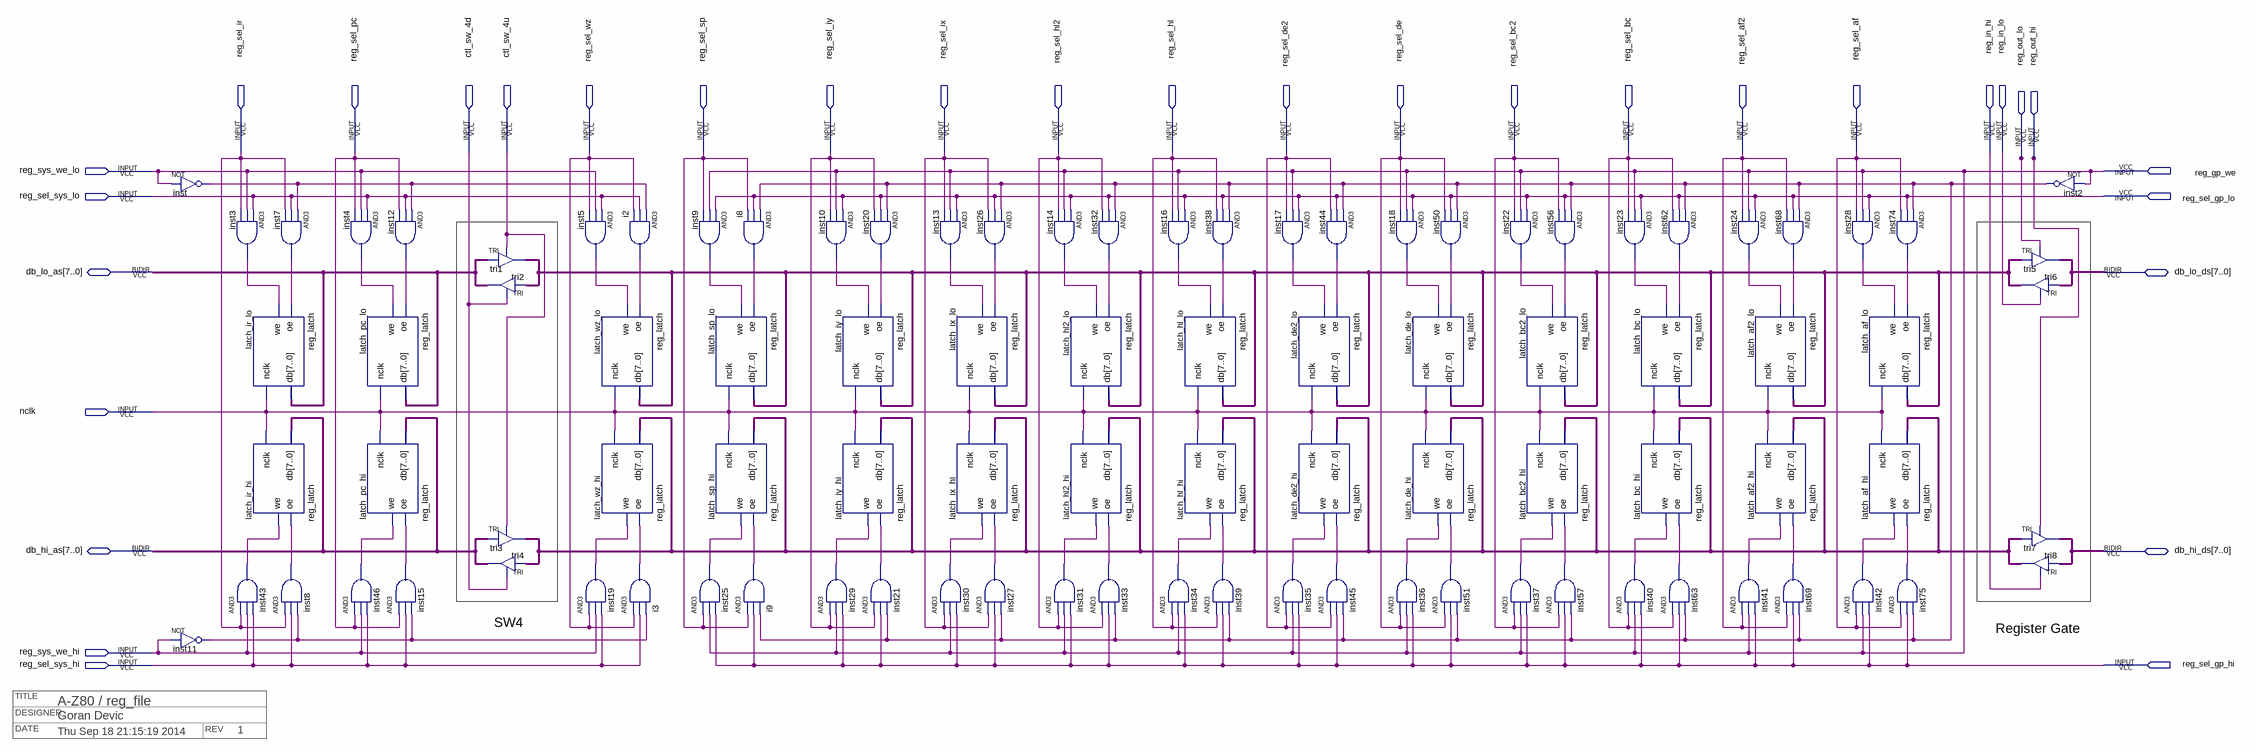
[diagram p0: schematic sheet]
// Quartus schematic reg_file.bdf as structural Verilog: 95 symbols, 32 pins
// Title block: TITLE: A-Z80 / reg_file; DESIGNER: Goran Devic; DATE: Thu Sep 18 21:15:19 2014; REV: 1
module reg_file (
  input  reg_sel_ir,
  input  reg_sel_pc,
  input  ctl_sw_4d,
  input  ctl_sw_4u,
  input  reg_sel_wz,
  input  reg_sel_sp,
  input  reg_sel_iy,
  input  reg_sel_ix,
  input  reg_sel_hl2,
  input  reg_sel_hl,
  input  reg_sel_de2,
  input  reg_sel_de,
  input  reg_sel_bc2,
  input  reg_sel_bc,
  input  reg_sel_af2,
  input  reg_sel_af,
  input  reg_in_hi,
  input  reg_in_lo,
  input  reg_out_lo,
  input  reg_out_hi,
  input  reg_sys_we_lo,
  input  reg_gp_we,
  input  reg_sel_sys_lo,
  input  reg_sel_gp_lo,
  input  nclk,
  input  reg_sys_we_hi,
  input  reg_sel_sys_hi,
  input  reg_sel_gp_hi,
  inout  [7:0] db_lo_as,
  inout  [7:0] db_lo_ds,
  inout  [7:0] db_hi_as,
  inout  [7:0] db_hi_ds
);

  wire i2_out, i3_out, i8_out, i9_out, inst2_out, inst3_out, inst4_out, inst5_out, inst7_out, inst8_out,
       inst9_out, inst10_out, inst11_out, inst12_out, inst13_out, inst14_out, inst15_out, inst16_out,
       inst17_out, inst18_out, inst19_out, inst20_out, inst21_out, inst22_out, inst23_out, inst24_out,
       inst25_out, inst26_out, inst27_out, inst28_out, inst29_out, inst30_out, inst31_out, inst32_out,
       inst33_out, inst34_out, inst35_out, inst36_out, inst37_out, inst38_out, inst39_out, inst40_out,
       inst41_out, inst42_out, inst43_out, inst44_out, inst45_out, inst46_out, inst50_out, inst51_out,
       inst56_out, inst57_out, inst62_out, inst63_out, inst68_out, inst69_out, inst74_out, inst75_out,
       inst_out;
  wire [7:0] tri1_out, tri3_out;

  not inst (inst_out, reg_sys_we_lo);
  not inst11 (inst11_out, reg_sys_we_hi);
  and inst3 (inst3_out, reg_sel_sys_lo, reg_sys_we_lo, reg_sel_ir);
  and inst43 (inst43_out, reg_sel_ir, reg_sys_we_hi, reg_sel_sys_hi);
  and inst7 (inst7_out, inst_out, reg_sel_sys_lo, reg_sel_ir);
  reg_latch latch_ir_lo (.oe(inst7_out), .nclk(nclk), .we(inst3_out), .db(db_lo_as));
  reg_latch latch_ir_hi (.oe(inst8_out), .nclk(nclk), .we(inst43_out), .db(db_hi_as));
  and inst8 (inst8_out, reg_sel_ir, reg_sel_sys_hi, inst11_out);
  and inst12 (inst12_out, inst_out, reg_sel_sys_lo, reg_sel_pc);
  and inst4 (inst4_out, reg_sel_sys_lo, reg_sys_we_lo, reg_sel_pc);
  reg_latch latch_pc_lo (.oe(inst12_out), .nclk(nclk), .we(inst4_out), .db(db_lo_as));
  reg_latch latch_pc_hi (.oe(inst15_out), .nclk(nclk), .we(inst46_out), .db(db_hi_as));
  and inst15 (inst15_out, reg_sel_pc, reg_sel_sys_hi, inst11_out);
  and inst46 (inst46_out, reg_sel_pc, reg_sys_we_hi, reg_sel_sys_hi);
  TRI \tri1 [7:0] (.IN(db_lo_as), .OE(ctl_sw_4u), .OUT(tri1_out));
  TRI tri2[7:0] (.IN(tri1_out), .OE(ctl_sw_4d), .OUT(db_lo_as));
  TRI tri3[7:0] (.IN(db_hi_as), .OE(ctl_sw_4u), .OUT(tri3_out));
  TRI tri4[7:0] (.IN(tri3_out), .OE(ctl_sw_4d), .OUT(db_hi_as));
  and inst5 (inst5_out, reg_sel_sys_lo, reg_sys_we_lo, reg_sel_wz);
  reg_latch latch_wz_lo (.oe(i2_out), .nclk(nclk), .we(inst5_out), .db(tri1_out));
  reg_latch latch_wz_hi (.oe(i3_out), .nclk(nclk), .we(inst19_out), .db(tri3_out));
  and inst19 (inst19_out, reg_sel_wz, reg_sys_we_hi, reg_sel_sys_hi);
  and i2 (i2_out, inst_out, reg_sel_sys_lo, reg_sel_wz);
  and i3 (i3_out, reg_sel_wz, reg_sel_sys_hi, inst11_out);
  and inst9 (inst9_out, reg_sel_gp_lo, reg_gp_we, reg_sel_sp);
  and inst25 (inst25_out, reg_sel_sp, reg_gp_we, reg_sel_gp_hi);
  and i8 (i8_out, inst2_out, reg_sel_gp_lo, reg_sel_sp);
  reg_latch latch_sp_lo (.oe(i8_out), .nclk(nclk), .we(inst9_out), .db(tri1_out));
  reg_latch latch_sp_hi (.oe(i9_out), .nclk(nclk), .we(inst25_out), .db(tri3_out));
  and i9 (i9_out, reg_sel_sp, reg_sel_gp_hi, inst2_out);
  and inst10 (inst10_out, reg_sel_gp_lo, reg_gp_we, reg_sel_iy);
  reg_latch latch_iy_lo (.oe(inst20_out), .nclk(nclk), .we(inst10_out), .db(tri1_out));
  reg_latch latch_iy_hi (.oe(inst21_out), .nclk(nclk), .we(inst29_out), .db(tri3_out));
  and inst29 (inst29_out, reg_sel_iy, reg_gp_we, reg_sel_gp_hi);
  and inst20 (inst20_out, inst2_out, reg_sel_gp_lo, reg_sel_iy);
  and inst21 (inst21_out, reg_sel_iy, reg_sel_gp_hi, inst2_out);
  and inst13 (inst13_out, reg_sel_gp_lo, reg_gp_we, reg_sel_ix);
  reg_latch latch_ix_lo (.oe(inst26_out), .nclk(nclk), .we(inst13_out), .db(tri1_out));
  reg_latch latch_ix_hi (.oe(inst27_out), .nclk(nclk), .we(inst30_out), .db(tri3_out));
  and inst30 (inst30_out, reg_sel_ix, reg_gp_we, reg_sel_gp_hi);
  and inst26 (inst26_out, inst2_out, reg_sel_gp_lo, reg_sel_ix);
  and inst27 (inst27_out, reg_sel_ix, reg_sel_gp_hi, inst2_out);
  and inst14 (inst14_out, reg_sel_gp_lo, reg_gp_we, reg_sel_hl2);
  and inst31 (inst31_out, reg_sel_hl2, reg_gp_we, reg_sel_gp_hi);
  and inst32 (inst32_out, inst2_out, reg_sel_gp_lo, reg_sel_hl2);
  reg_latch latch_hl2_lo (.oe(inst32_out), .nclk(nclk), .we(inst14_out), .db(tri1_out));
  reg_latch latch_hl2_hi (.oe(inst33_out), .nclk(nclk), .we(inst31_out), .db(tri3_out));
  and inst33 (inst33_out, reg_sel_hl2, reg_sel_gp_hi, inst2_out);
  and inst16 (inst16_out, reg_sel_gp_lo, reg_gp_we, reg_sel_hl);
  reg_latch latch_hl_lo (.oe(inst38_out), .nclk(nclk), .we(inst16_out), .db(tri1_out));
  reg_latch latch_hl_hi (.oe(inst39_out), .nclk(nclk), .we(inst34_out), .db(tri3_out));
  and inst34 (inst34_out, reg_sel_hl, reg_gp_we, reg_sel_gp_hi);
  and inst38 (inst38_out, inst2_out, reg_sel_gp_lo, reg_sel_hl);
  and inst39 (inst39_out, reg_sel_hl, reg_sel_gp_hi, inst2_out);
  and inst17 (inst17_out, reg_sel_gp_lo, reg_gp_we, reg_sel_de2);
  reg_latch latch_de2_lo (.oe(inst44_out), .nclk(nclk), .we(inst17_out), .db(tri1_out));
  reg_latch latch_de2_hi (.oe(inst45_out), .nclk(nclk), .we(inst35_out), .db(tri3_out));
  and inst35 (inst35_out, reg_sel_de2, reg_gp_we, reg_sel_gp_hi);
  and inst44 (inst44_out, inst2_out, reg_sel_gp_lo, reg_sel_de2);
  and inst45 (inst45_out, reg_sel_de2, reg_sel_gp_hi, inst2_out);
  and inst18 (inst18_out, reg_sel_gp_lo, reg_gp_we, reg_sel_de);
  reg_latch latch_de_lo (.oe(inst50_out), .nclk(nclk), .we(inst18_out), .db(tri1_out));
  reg_latch latch_de_hi (.oe(inst51_out), .nclk(nclk), .we(inst36_out), .db(tri3_out));
  and inst36 (inst36_out, reg_sel_de, reg_gp_we, reg_sel_gp_hi);
  and inst50 (inst50_out, inst2_out, reg_sel_gp_lo, reg_sel_de);
  and inst51 (inst51_out, reg_sel_de, reg_sel_gp_hi, inst2_out);
  and inst22 (inst22_out, reg_sel_gp_lo, reg_gp_we, reg_sel_bc2);
  and inst37 (inst37_out, reg_sel_bc2, reg_gp_we, reg_sel_gp_hi);
  and inst56 (inst56_out, inst2_out, reg_sel_gp_lo, reg_sel_bc2);
  reg_latch latch_bc2_lo (.oe(inst56_out), .nclk(nclk), .we(inst22_out), .db(tri1_out));
  reg_latch latch_bc2_hi (.oe(inst57_out), .nclk(nclk), .we(inst37_out), .db(tri3_out));
  and inst57 (inst57_out, reg_sel_bc2, reg_sel_gp_hi, inst2_out);
  and inst23 (inst23_out, reg_sel_gp_lo, reg_gp_we, reg_sel_bc);
  reg_latch latch_bc_lo (.oe(inst62_out), .nclk(nclk), .we(inst23_out), .db(tri1_out));
  reg_latch latch_bc_hi (.oe(inst63_out), .nclk(nclk), .we(inst40_out), .db(tri3_out));
  and inst40 (inst40_out, reg_sel_bc, reg_gp_we, reg_sel_gp_hi);
  and inst62 (inst62_out, inst2_out, reg_sel_gp_lo, reg_sel_bc);
  and inst63 (inst63_out, reg_sel_bc, reg_sel_gp_hi, inst2_out);
  and inst24 (inst24_out, reg_sel_gp_lo, reg_gp_we, reg_sel_af2);
  reg_latch latch_af2_lo (.oe(inst68_out), .nclk(nclk), .we(inst24_out), .db(tri1_out));
  reg_latch latch_af2_hi (.oe(inst69_out), .nclk(nclk), .we(inst41_out), .db(tri3_out));
  and inst41 (inst41_out, reg_sel_af2, reg_gp_we, reg_sel_gp_hi);
  and inst68 (inst68_out, inst2_out, reg_sel_gp_lo, reg_sel_af2);
  and inst69 (inst69_out, reg_sel_af2, reg_sel_gp_hi, inst2_out);
  and inst28 (inst28_out, reg_sel_gp_lo, reg_gp_we, reg_sel_af);
  reg_latch latch_af_lo (.oe(inst74_out), .nclk(nclk), .we(inst28_out), .db(tri1_out));
  reg_latch latch_af_hi (.oe(inst75_out), .nclk(nclk), .we(inst42_out), .db(tri3_out));
  and inst42 (inst42_out, reg_sel_af, reg_gp_we, reg_sel_gp_hi);
  and inst74 (inst74_out, inst2_out, reg_sel_gp_lo, reg_sel_af);
  and inst75 (inst75_out, reg_sel_af, reg_sel_gp_hi, inst2_out);
  not inst2 (inst2_out, reg_gp_we);
  TRI tri5[7:0] (.IN(tri1_out), .OE(reg_out_lo), .OUT(db_lo_ds));
  TRI tri6[7:0] (.IN(db_lo_ds), .OE(reg_in_lo), .OUT(tri1_out));
  TRI tri7[7:0] (.IN(tri3_out), .OE(reg_out_hi), .OUT(db_hi_ds));
  TRI tri8[7:0] (.IN(db_hi_ds), .OE(reg_in_hi), .OUT(tri3_out));

  // Notes on the sheet:
  //   SW4
  //   Register Gate
endmodule
